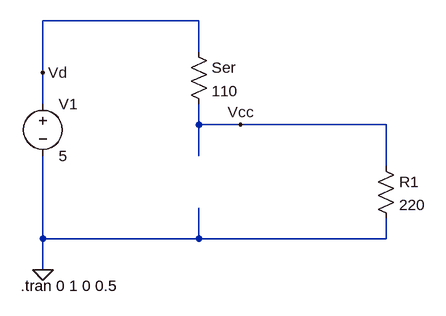
[diagram p0: schematic divider.asc]
divider.asc, the LTspice schematic file:
Version 4
SHEET 1 880 680
WIRE 144 48 -96 48
WIRE 144 96 144 48
WIRE -96 128 -96 48
WIRE -96 176 -96 128
WIRE 144 208 144 176
WIRE 208 208 144 208
WIRE 432 208 208 208
WIRE 144 256 144 208
WIRE 432 272 432 208
WIRE -96 384 -96 256
WIRE 144 384 144 336
WIRE 144 384 -96 384
WIRE 432 384 432 352
WIRE 432 384 144 384
WIRE -96 432 -96 384
FLAG -96 432 0
FLAG -96 128 Vd
FLAG 208 208 Vcc
SYMBOL res 128 80 R0
SYMATTR InstName Ser
SYMATTR Value 110
SYMBOL voltage -96 160 R0
WINDOW 123 0 0 Left 2
WINDOW 39 0 0 Left 2
SYMATTR InstName V1
SYMATTR Value 5
SYMBOL res 416 256 R0
SYMATTR InstName R1
SYMATTR Value 220
TEXT -130 456 Left 2 !.tran 0 1 0 0.5

The netlist it stands for:
* divider.asc
R§Ser Vd Vcc 110
V1 Vd 0 5
R1 Vcc 0 220
.tran 0 1 0 0.5
.backanno
.end